# EAGLE schematic control_alpha0001 (EAGLE 6.4)
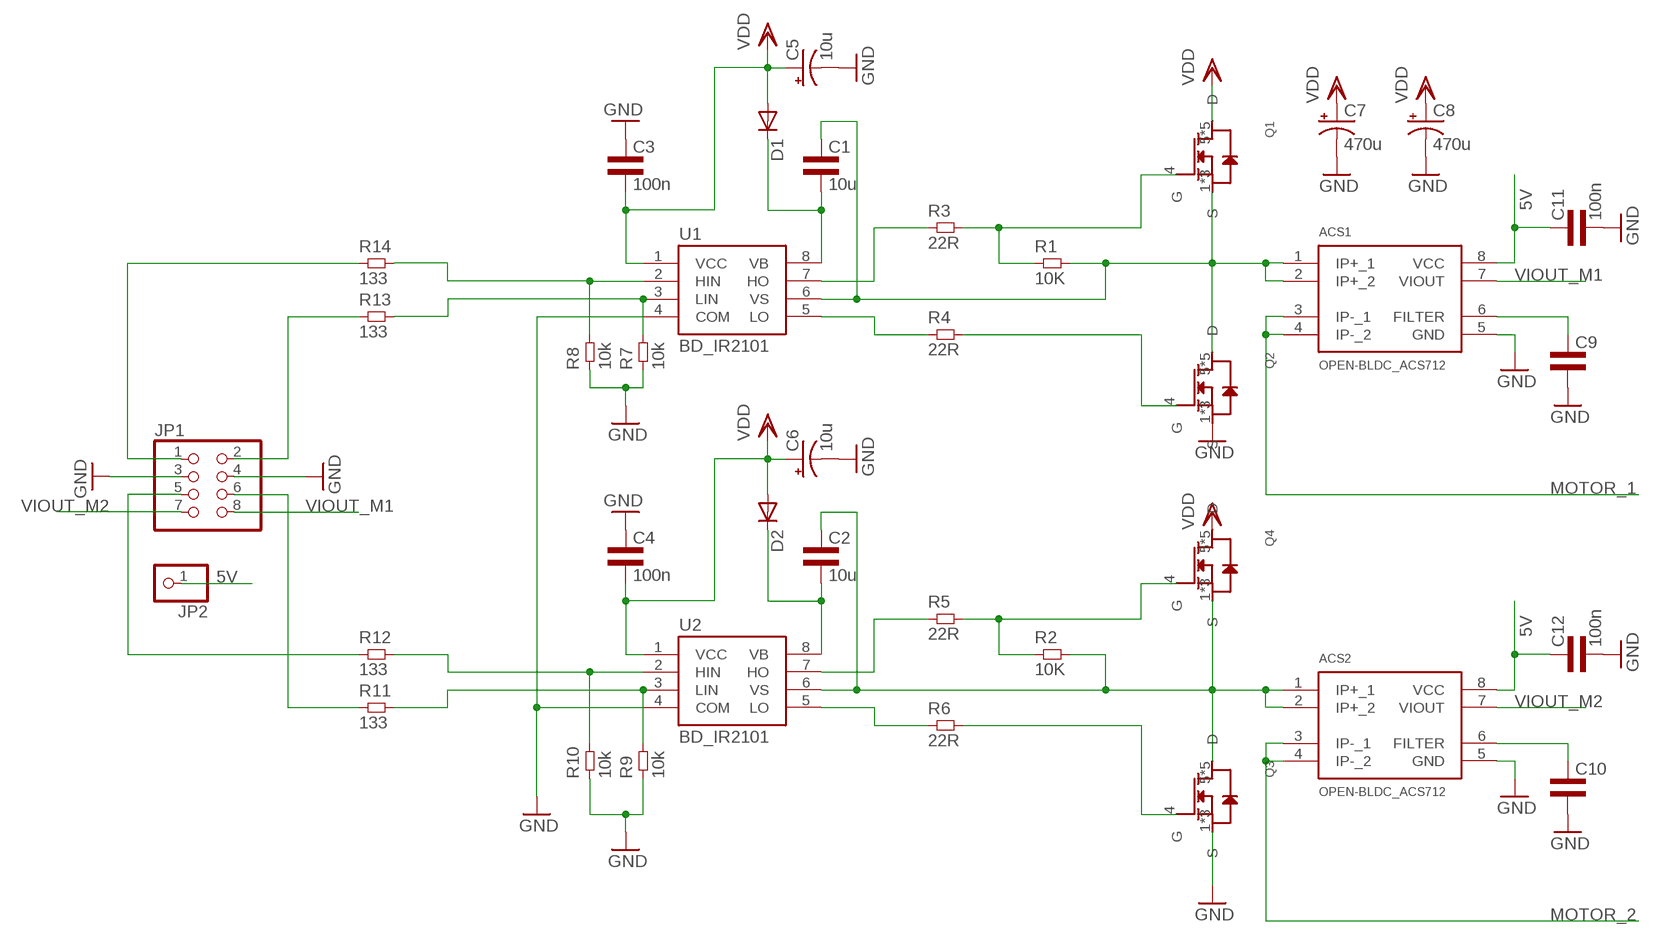
[diagram p0: schematic, sheet 1]

## Parts
ACS1  OPEN-BLDC_ACS712  [OPEN-BLDC_SO8]
ACS2  OPEN-BLDC_ACS712  [OPEN-BLDC_SO8]
C1  10u  CAP0805L3  [0805L3]
C2  10u  CAP0805L3  [0805L3]
C3  100n  CAP0603L3  [0603L3]
C4  100n  CAP0603L3  [0603L3]
C5  10u  CPOL-USE1.8-4  [E1,8-4]
C6  10u  CPOL-USE1.8-4  [E1,8-4]
C7  470u  CPOL-USE5-8.5  [E5-8,5]
C8  470u  CPOL-USE5-8.5  [E5-8,5]
C9  CAP0603L3  [0603L3]
C10  CAP0603L3  [0603L3]
C11  100n  CAP0603L3  [0603L3]
C12  100n  CAP0603L3  [0603L3]
D1  DIODE-SMB  [SMB]
D2  DIODE-SMB  [SMB]
JP1  PINHD-2X4  [2X04]
JP2  PINHD-1X1  [1X01]
Q1  CSD18540Q5B  [Q5B]
Q2  CSD18540Q5B  [Q5B]
Q3  CSD18540Q5B  [Q5B]
Q4  CSD18540Q5B  [Q5B]
R1  10K  RES0805L3  [0805L3]
R2  10K  RES0805L3  [0805L3]
R3  22R  RES0805L3  [0805L3]
R4  22R  RES0805L3  [0805L3]
R5  22R  RES0805L3  [0805L3]
R6  22R  RES0805L3  [0805L3]
R7  10k  RES0603L3  [0603L3]
R8  10k  RES0603L3  [0603L3]
R9  10k  RES0603L3  [0603L3]
R10  10k  RES0603L3  [0603L3]
R11  133  RES0603L3  [0603L3]
R12  133  RES0603L3  [0603L3]
R13  133  RES0603L3  [0603L3]
R14  133  RES0603L3  [0603L3]
U1  BD_IR2101  [SO8]
U2  BD_IR2101  [SO8]

## Nets
5V: ACS1.8(VCC) ACS2.8(VCC) C11.P$1 C12.P$1 JP2.1
GND: ACS1.5(GND) ACS2.5(GND) C3.P$1 C4.P$1 C5.- C6.- C7.- C8.- C9.P$2 C10.P$2 C11.P$2 C12.P$2 JP1.3 JP1.4 Q2.1(S) Q2.2(S) Q2.3(S) Q3.1(S) Q3.2(S) Q3.3(S) R7.P$1 R8.P$1 R9.P$1 R10.P$1 U1.4(COM) U2.4(COM)
HIN1_IN: JP1.1 R14.P$1
HIN2: R10.P$2 R12.P$2 U2.2(HIN)
HIN2_IN: JP1.5 R12.P$1
HO1: R3.1 U1.7(HO)
HO1_GATE: Q1.4(G) R1.1 R3.2
HO2: R5.1 U2.7(HO)
HO2_GATE: Q4.4(G) R2.1 R5.2
LIN1: R7.P$2 R13.P$2 U1.3(LIN)
LIN1_IN: JP1.2 R13.P$1
LIN2: R9.P$2 R11.P$2 U2.3(LIN)
LIN2_IN: JP1.6 R11.P$1
LO1: R4.1 U1.5(LO)
LO1_GATE: Q2.4(G) R4.2
LO2: R6.1 U2.5(LO)
LO2_GATE: Q3.4(G) R6.2
MOTOR_1: ACS1.3(IP-_1) ACS1.4(IP-_2)
MOTOR_2: ACS2.3(IP-_1) ACS2.4(IP-_2)
MOTOR_OUT_1: ACS1.1(IP+_1) ACS1.2(IP+_2) C1.1 Q1.1(S) Q1.2(S) Q1.3(S) Q2.5(D) Q2.6(D) Q2.7(D) Q2.8(D) Q2.9(D) R1.2 U1.6(VS)
MOTOR_OUT_2: ACS2.1(IP+_1) ACS2.2(IP+_2) C2.1 Q3.5(D) Q3.6(D) Q3.7(D) Q3.8(D) Q3.9(D) Q4.1(S) Q4.2(S) Q4.3(S) R2.2 U2.6(VS)
N$3: R8.P$2 R14.P$2 U1.2(HIN)
N$4: ACS1.6(FILTER) C9.P$1
N$5: ACS2.6(FILTER) C10.P$1
N$7: C1.2 D1.C U1.8(VB)
N$8: C2.2 D2.C U2.8(VB)
VDD: C3.P$2 C4.P$2 C5.+ C6.+ C7.+ C8.+ D1.A D2.A Q1.5(D) Q1.6(D) Q1.7(D) Q1.8(D) Q1.9(D) Q4.5(D) Q4.6(D) Q4.7(D) Q4.8(D) Q4.9(D) U1.1(VCC) U2.1(VCC)
VIOUT_M1: ACS1.7(VIOUT) JP1.8
VIOUT_M2: ACS2.7(VIOUT) JP1.7

## Library data of the parts
ACS1 ACS2 = power:OPEN-BLDC_ACS712
C1-C4 C9-C12 = common:CAP
C5-C8 = rcl:CPOL-US: POLARIZED CAPACITOR, American symbol
D1 D2 = diode:DIODE-: DIODE
JP1 = pinhead:PINHD-2X4: PIN HEADER
JP2 = pinhead:PINHD-1X1: PIN HEADER
Q1-Q4 = common:CSD18540Q5B: N-Channel High-Power MosFET; I_MAX: 221A; PD: 195W; PULSED_DRAIN_CURRENT: 400A; VGS: +/- 20V; V_MAX: 60V
R1-R14 = common:RES
U1 U2 = open-bldc:BD